# EAGLE design PhMeter_1 (EAGLE 7.2.0)
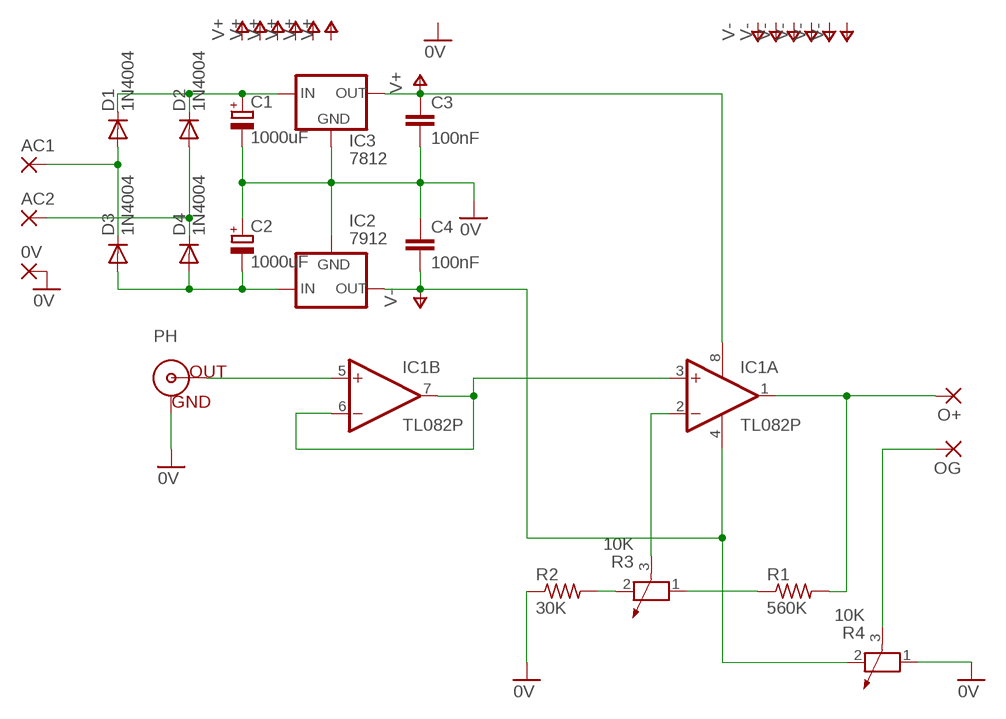
[diagram p0: schematic, sheet 1]

## Parts
0V  1,6/0,8  [1,6/0,8]
AC1  1,6/0,8  [1,6/0,8]
AC2  1,6/0,8  [1,6/0,8]
C1  1000uF  CPOL-EUE7.5-18  [E7,5-18]
C2  1000uF  CPOL-EUE7.5-18  [E7,5-18]
C3  100nF  C-EU050-025X075  [C050-025X075]
C4  100nF  C-EU050-025X075  [C050-025X075]
D1  1N4004  [DO41-10]
D2  1N4004  [DO41-10]
D3  1N4004  [DO41-10]
D4  1N4004  [DO41-10]
IC1  TL082P  [DIL08]
IC2  7912  79XXS  [79XXS]
IC3  7812  78XXS  [78XXS]
O+  1,6/0,8  [1,6/0,8]
OG  1,6/0,8  [1,6/0,8]
PH  BNCPTH  [BNC]
R1  560K  R-US_0207/10  [0207/10]
R2  30K  R-US_0207/10  [0207/10]
R3  10K  POTENTIOMETER_PT-10  [PT-10]
R4  10K  POTENTIOMETER_PT-10  [PT-10]

## Nets
0V: 0V.1(P) C1.- C2.+ C3.2 C4.1 IC2.GND IC3.GND PH.GND R2.1 R4.1
AC1: AC1.1(P) D1.A D3.C
N$2: IC1.3(A:+IN) IC1.6(B:-IN) IC1.7(B:OUT)
N$3: R2.2 R3.2
N$4: AC2.1(P) D2.A D4.C
N$5: C1.+ D1.C D2.C IC3.IN
N$6: C2.- D3.A D4.A IC2.IN
N$7: R1.1 R3.1
N$8: IC1.1(A:OUT) O+.1(P) R1.2
N$9: IC1.2(A:-IN) R3.3
N$10: OG.1(P) R4.3
N$11: IC1.5(B:+IN) PH.S(OUT)
V+: C3.1 IC1.8(P:V+) IC3.OUT
V-: C4.2 IC1.4(P:V-) IC2.OUT R4.2

## Library data of the parts
0V AC1 AC2 O+ OG = wirepad:1,6/0,8: THROUGH-HOLE PAD
C1 C2 = rcl:CPOL-EU: POLARIZED CAPACITOR, European symbol
C3 C4 = rcl:C-EU: CAPACITOR, European symbol
D1-D4 = adafruit:1N4004: DIODE General purpose 1N400x type rectifier (With bigger pads) http://www.ladyada.net/library/pcb/eaglelibrary.html
IC1 = linear:TL082: OP AMP Data sheet <http://www.ti.com/lit/ds/symlink/tl084a . pdf>; DATA_SHEET: <a href="http://www.ti.com/lit/ds/symlink/tl084a.pdf"> Data sheet </a>
IC2 = v-reg:79XXS: VOLTAGE REGULATOR
IC3 = v-reg:78XXS: VOLTAGE REGULATOR
PH = SparkFun-Connectors:BNC: BNC Connector, Mouser Part# 5227161
R1 R2 = resistor:R-US_: RESISTOR, American symbol
R3 R4 = rcl:POTENTIOMETER_: Potentiometer

## Board
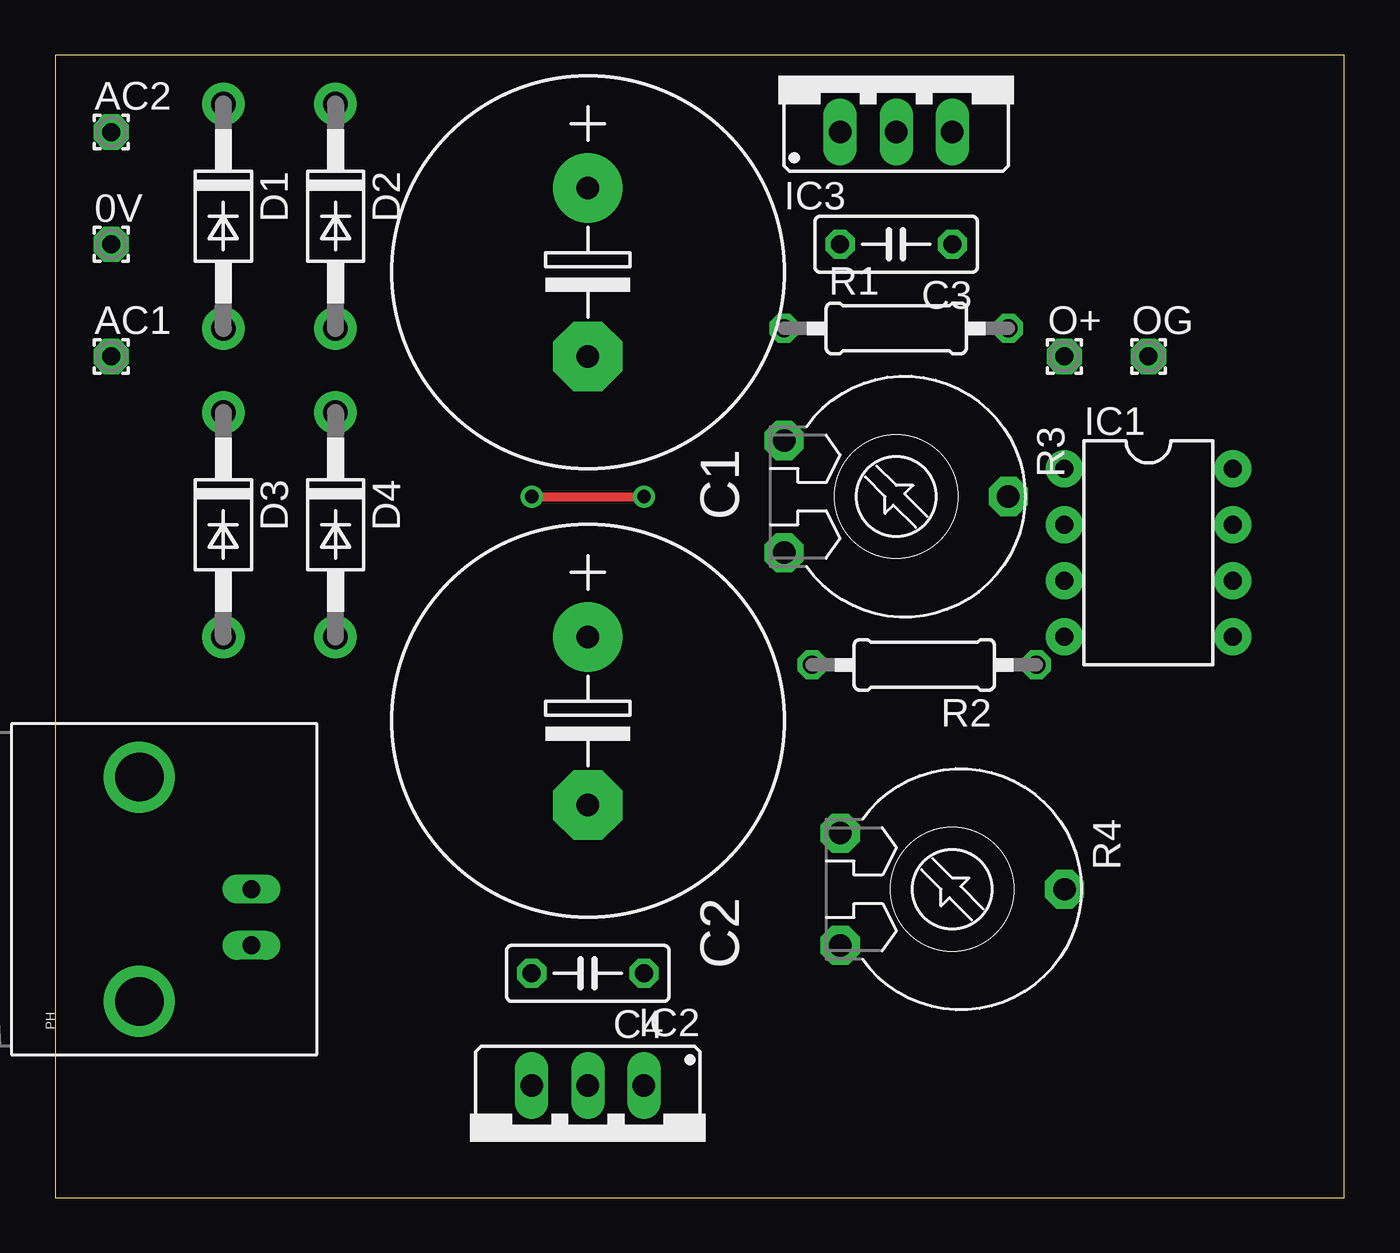
[diagram p1: board, top side]
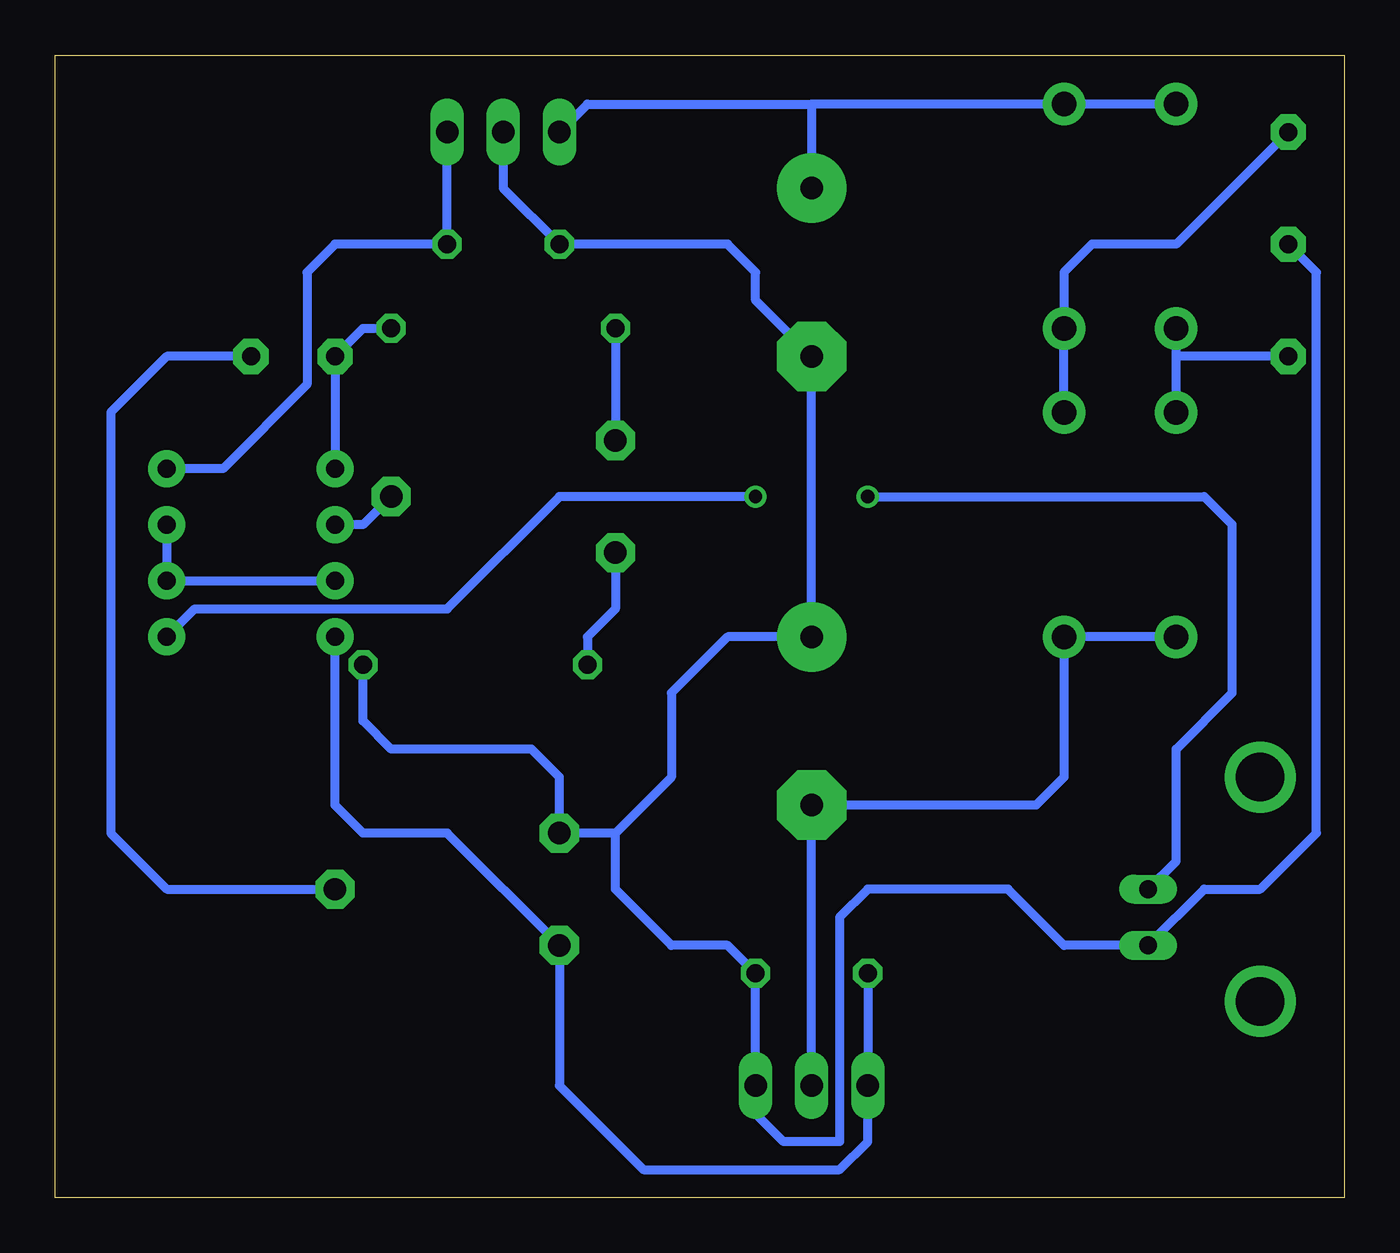
[diagram p2: board, bottom side, seen from below]

Size 58.4 x 51.74 mm. Coordinates in mm from the lower left corner, seen from the top.
Outline: 0,0 58.4,0 58.4,51.74 0,51.74 0,0
Copper layers (1*16): Top 0.035mm / dielectric 1.5mm / Bottom 0.035mm
Design rules "default": minimum track width 10mil, minimum drill 24mil, track to track 8mil, track to pad 8mil, pad to pad 8mil, via to via 8mil, smd to smd 8mil, copper to edge 40mil, drill to drill 8mil, minimum pad ring 10mil, minimum via ring 8mil, stop-mask expansion 4mil, vias tented up to drill 0mil, thermal gap 10mil

### Footprints (pad centres in the part's own frame; a part is rotated, then mirrored left to right if it is on the bottom)
1,6/0,8 = drill 0.813 pad 1.6 octagon: 1 0,0
E7,5-18 = drill 1.016 pad 3.15: + -3.81,0 | drill 1.016 pad 3.15 octagon: - 3.81,0
C050-025X075 = drill 0.813 octagon: 1 -2.54,0; 2 2.54,0
DO41-10 = drill 1.118 pad 1.93: A 5.08,0; C -5.08,0
DIL08 = drill 0.813 pad 1.676: 1 -3.81,-3.81; 2 -1.27,-3.81; 3 1.27,-3.81; 4 3.81,-3.81; 5 3.81,3.81; 6 1.27,3.81; 7 -1.27,3.81; 8 -3.81,3.81
79XXS = drill 1.016 long: GND -2.54,-2.54; IN 0,-2.54; OUT 2.54,-2.54
78XXS = drill 1.016 long: GND 0,-2.54; IN -2.54,-2.54; OUT 2.54,-2.54
BNC = drill 2.2: 3 -5.08,5.08; 4 5.08,5.08 | drill 0.8 long: GND -2.54,0; S 0,0
0207/10 = drill 0.813 octagon: 1 -5.08,0; 2 5.08,0
PT-10 = drill 1.016 pad 1.778 octagon: 1 -2.54,-5.08; 2 2.54,-5.08; 3 0,5.08

### Placement (x,y rotation side)
0V  2.54,43.18 0 top
AC1  2.54,38.1 0 top
AC2  2.54,48.26 0 top
C1  24.13,41.91 270 top
C2  24.13,21.59 270 top
C3  38.1,43.18 180 top
C4  24.13,10.16 180 top
D1  7.62,44.45 270 top
D2  12.7,44.45 270 top
D3  7.62,30.48 270 top
D4  12.7,30.48 270 top
IC1  49.53,29.21 270 top
IC2  24.13,2.54 180 top
IC3  38.1,50.8 0 top
O+  45.72,38.1 0 top
OG  49.53,38.1 0 top
PH  8.89,13.97 90 top
R1  38.1,39.37 0 top
R2  39.37,24.13 180 top
R3  38.1,31.75 270 top
R4  40.64,13.97 270 top

### Tracks (layer width: path | path; a pad name or v marks a point on that pad's centre or on a via)
0V
  Bottom 0.406: IC3.GND 38.1,45.72 C3.2 27.94,43.18 26.67,41.91 26.67,40.64 C1.- C2.+ 27.94,25.4 30.48,22.86 30.48,19.05 33.02,16.51 | 0V.1 1.27,41.91 1.27,16.51 3.81,13.97 6.35,13.97 PH.GND 12.7,11.43 15.24,13.97 21.59,13.97 22.86,12.7 22.86,2.54 25.4,2.54 26.67,3.81 IC2.GND C4.1 27.94,11.43 30.48,11.43 33.02,13.97 33.02,16.51 | 33.02,16.51 R4.1 35.56,19.05 36.83,20.32 43.18,20.32 44.45,21.59 R2.1
AC1
  Bottom 0.406: D3.C 7.62,38.1 | 7.62,38.1 D1.A | AC1.1 7.62,38.1
N$2
  Bottom 0.406: IC1.7 IC1.6 IC1.3
N$3
  Bottom 0.406: R3.2 33.02,26.67 34.29,25.4 R2.2
N$4
  Bottom 0.406: D4.C D2.A 12.7,41.91 11.43,43.18 7.62,43.18 AC2.1
N$5
  Bottom 0.406: D1.C D2.C 24.13,49.53 | 24.13,49.53 C1.+ | IC3.IN 34.29,49.53 24.13,49.53
N$6
  Bottom 0.406: D3.A D4.A 12.7,19.05 13.97,17.78 C2.- IC2.IN
N$7
  Bottom 0.406: R1.1 R3.1
N$8
  Bottom 0.406: IC1.1 O+.1 44.45,39.37 R1.2
N$9
  Bottom 0.406: R3.3 44.45,30.48 IC1.2
N$10
  Bottom 0.406: OG.1 53.34,38.1 55.88,35.56 55.88,16.51 53.34,13.97 R4.3
N$11  (via drill 0.6)
  Top 0.406: v21.59,31.75 v26.67,31.75
  Bottom 0.406: PH.S 7.62,15.24 7.62,20.32 5.08,22.86 5.08,30.48 6.35,31.75 v21.59,31.75 | IC1.5 52.07,26.67 40.64,26.67 35.56,31.75 v26.67,31.75
V+
  Bottom 0.406: IC1.8 50.8,33.02 46.99,36.83 46.99,41.91 45.72,43.18 C3.1 IC3.OUT
V-
  Bottom 0.406: C4.2 IC2.OUT 21.59,2.54 22.86,1.27 31.75,1.27 35.56,5.08 R4.2 40.64,16.51 44.45,16.51 45.72,17.78 IC1.4